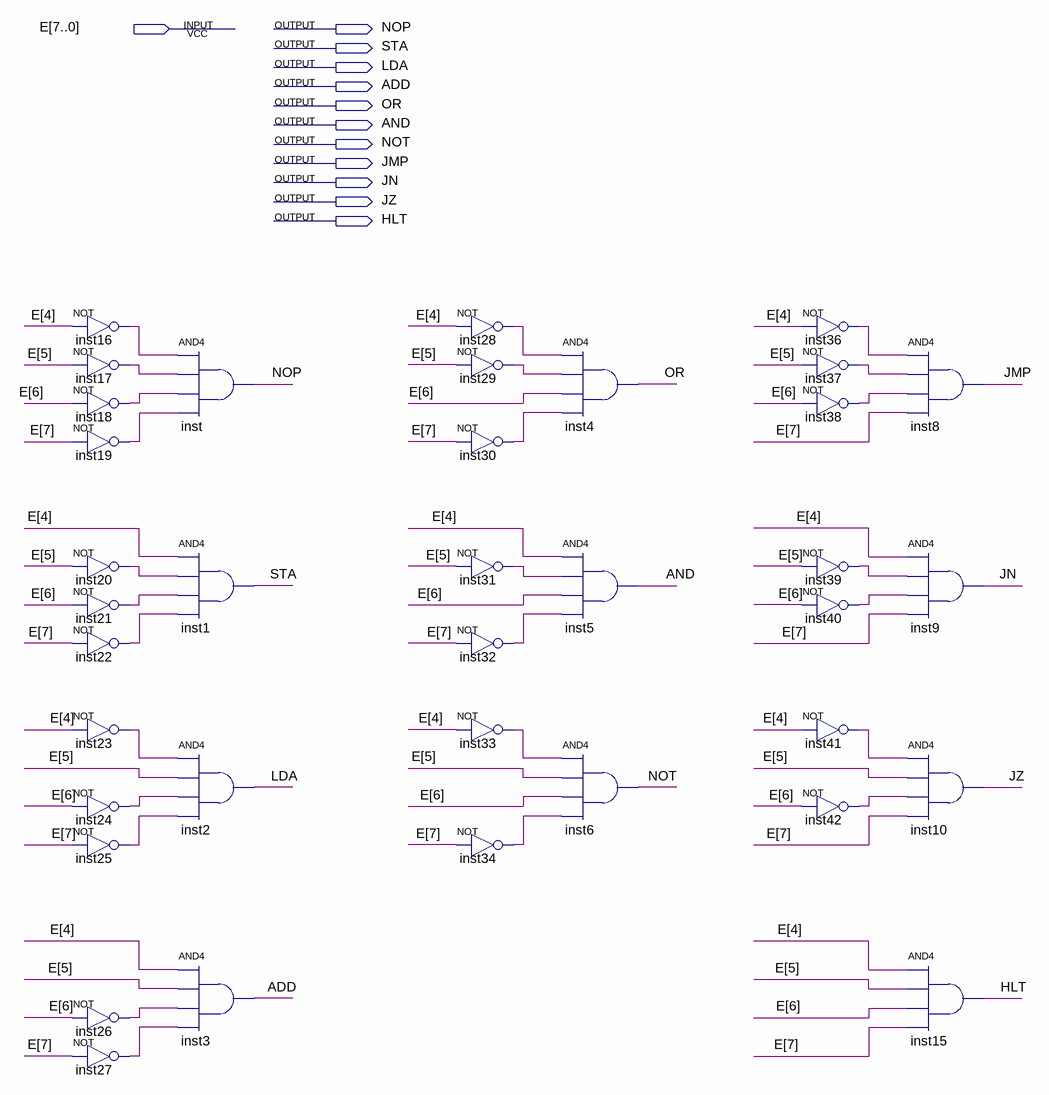
[diagram p0: schematic sheet]
// Quartus schematic Decod.bdf as structural Verilog: 37 symbols, 12 pins
module Decod (
  input  [7:0] E,
  output NOP,
  output STA,
  output LDA,
  output ADD,
  output OR,
  output AND,
  output NOT,
  output JMP,
  output JN,
  output JZ,
  output HLT
);

  wire inst16_out, inst17_out, inst18_out, inst19_out, inst20_out, inst21_out, inst22_out, inst23_out,
       inst24_out, inst25_out, inst26_out, inst27_out, inst28_out, inst29_out, inst30_out, inst31_out,
       inst32_out, inst33_out, inst34_out, inst36_out, inst37_out, inst38_out, inst39_out, inst40_out,
       inst41_out, inst42_out;

  not inst16 (inst16_out, E[4]);
  not inst17 (inst17_out, E[5]);
  not inst18 (inst18_out, E[6]);
  not inst19 (inst19_out, E[7]);
  not inst20 (inst20_out, E[5]);
  not inst21 (inst21_out, E[6]);
  not inst22 (inst22_out, E[7]);
  not inst23 (inst23_out, E[4]);
  not inst24 (inst24_out, E[6]);
  not inst25 (inst25_out, E[7]);
  not inst26 (inst26_out, E[6]);
  not inst27 (inst27_out, E[7]);
  and inst (NOP, inst16_out, inst17_out, inst18_out, inst19_out);
  and inst1 (STA, E[4], inst20_out, inst21_out, inst22_out);
  and inst2 (LDA, inst23_out, E[5], inst24_out, inst25_out);
  and inst3 (ADD, E[4], E[5], inst26_out, inst27_out);
  not inst28 (inst28_out, E[4]);
  not inst29 (inst29_out, E[5]);
  not inst30 (inst30_out, E[7]);
  not inst31 (inst31_out, E[5]);
  not inst32 (inst32_out, E[7]);
  not inst33 (inst33_out, E[4]);
  not inst34 (inst34_out, E[7]);
  and inst4 (OR, inst28_out, inst29_out, E[6], inst30_out);
  and inst5 (AND, E[4], inst31_out, E[6], inst32_out);
  and inst6 (NOT, inst33_out, E[5], E[6], inst34_out);
  not inst36 (inst36_out, E[4]);
  not inst37 (inst37_out, E[5]);
  not inst38 (inst38_out, E[6]);
  not inst39 (inst39_out, E[5]);
  not inst40 (inst40_out, E[6]);
  not inst41 (inst41_out, E[4]);
  not inst42 (inst42_out, E[6]);
  and inst8 (JMP, inst36_out, inst37_out, inst38_out, E[7]);
  and inst9 (JN, E[4], inst39_out, inst40_out, E[7]);
  and inst10 (JZ, inst41_out, E[5], inst42_out, E[7]);
  and inst15 (HLT, E[4], E[5], E[6], E[7]);
endmodule
